# Altium project DAS_ad7606.PrjPcb
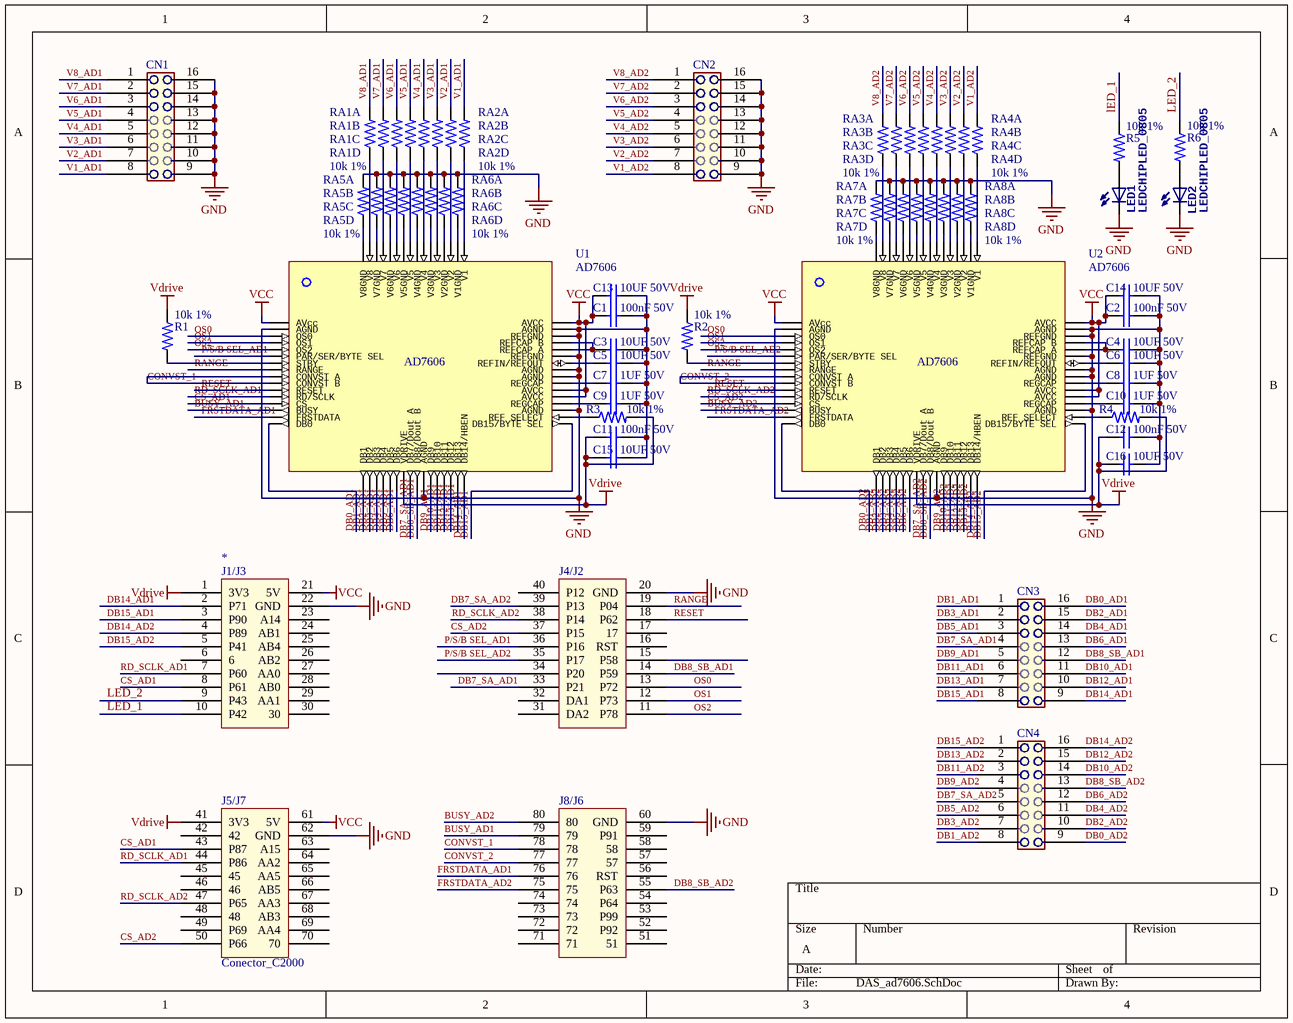
[diagram p0: DAS_ad7606.SchDoc]
1 sheet, 39 parts. Net scope: global (net labels, ports and power ports of the same name join across sheets).
Board file: DAS_ad7606.PcbDoc

## Sheet DAS_ad7606.SchDoc
size A

### Parts
*  Conector_C2000  [Conector_C2000]
C1  value 100nF 50V  [CAP0805_wave]  (hidden comment: SMD Capacitor)
C2  value 100nF 50V  [CAP0805_wave]  (hidden comment: SMD Capacitor)
C3  value 10UF 50V  [CAP0805_wave]  (hidden comment: SMD Capacitor)
C4  value 10UF 50V  [CAP0805_wave]  (hidden comment: SMD Capacitor)
C5  value 10UF 50V  [CAP0805_wave]  (hidden comment: SMD Capacitor)
C6  value 10UF 50V  [CAP0805_wave]  (hidden comment: SMD Capacitor)
C7  value 1UF 50V  [CAP0805_wave]  (hidden comment: SMD Capacitor)
C8  value 1UF 50V  [CAP0805_wave]  (hidden comment: SMD Capacitor)
C9  value 1UF 50V  [CAP0805_wave]  (hidden comment: SMD Capacitor)
C10  value 1UF 50V  [CAP0805_wave]  (hidden comment: SMD Capacitor)
C11  value 100nF 50V  [CAP0805_wave]  (hidden comment: SMD Capacitor)
C12  value 100nF 50V  [CAP0805_wave]  (hidden comment: SMD Capacitor)
C13  value 10UF 50V  [CAP0805_wave]  (hidden comment: SMD Capacitor)
C14  value 10UF 50V  [CAP0805_wave]  (hidden comment: SMD Capacitor)
C15  value 10UF 50V  [CAP0805_wave]  (hidden comment: SMD Capacitor)
C16  value 10UF 50V  [CAP0805_wave]  (hidden comment: SMD Capacitor)
CN1  Conector IDC Macho 16 Vias 90°  [HEADER 2x8 - 90g]  (value not drawn)
CN2  Conector IDC Macho 16 Vias 90°  [HEADER 2x8 - 90g]  (value not drawn)
CN3  Conector IDC Macho 16 Vias 90°  [HEADER 2x8 - 180g]  (value not drawn)
CN4  Conector IDC Macho 16 Vias 90°  [HEADER 2x8 - 180g]  (value not drawn)
LED1  LEDCHIPLED_0805  [CHIPLED_0805]
LED2  LEDCHIPLED_0805  [CHIPLED_0805]
R1  value 10k 1%  [RES0805_wave]  (hidden comment: Resistor 0805)
R2  value 10k 1%  [RES0805_wave]  (hidden comment: Resistor 0805)
R3  value 10k 1%  [RES0805_wave]  (hidden comment: Resistor 0805)
R4  value 10k 1%  [RES0805_wave]  (hidden comment: Resistor 0805)
R5  value 10k 1%  [RES0805_wave]  (hidden comment: Resistor 0805)
R6  value 10k 1%  [RES0805_wave]  (hidden comment: Resistor 0805)
RA1  Resistor Array 1206 4 vias  [RES_Array 1206 - 4 vias]  (value not drawn)  (parts A,B,C,D of 4)
RA2  Resistor Array 1206 4 vias  [RES_Array 1206 - 4 vias]  (value not drawn)  (parts A,B,C,D of 4)
RA3  Resistor Array 1206 4 vias  [RES_Array 1206 - 4 vias]  (value not drawn)  (parts A,B,C,D of 4)
RA4  Resistor Array 1206 4 vias  [RES_Array 1206 - 4 vias]  (value not drawn)  (parts A,B,C,D of 4)
RA5  Resistor Array 1206 4 vias  [RES_Array 1206 - 4 vias]  (value not drawn)  (parts A,B,C,D of 4)
RA6  Resistor Array 1206 4 vias  [RES_Array 1206 - 4 vias]  (value not drawn)  (parts A,B,C,D of 4)
RA7  Resistor Array 1206 4 vias  [RES_Array 1206 - 4 vias]  (value not drawn)  (parts A,B,C,D of 4)
RA8  Resistor Array 1206 4 vias  [RES_Array 1206 - 4 vias]  (value not drawn)  (parts A,B,C,D of 4)
U1  AD7606  [LQFP ST-64-2]
U2  AD7606  [LQFP ST-64-2]

### Nets
GND: *.20(GND) *.22(GND) *.60(GND) *.62(GND) C1.1 C2.1 C3.1 C4.1 C5.1 C6.1 C7.1 C8.1 C9.1 C10.1 C11.1 C12.1 C13.1 C14.1 C15.1 C16.1 CN1.9 CN1.10 CN1.11 CN1.12 CN1.13 CN1.14 CN1.15 CN1.16 CN2.9 CN2.10 CN2.11 CN2.12 CN2.13 CN2.14 CN2.15 CN2.16 LED1.C LED2.C RA5.R1B RA5.R2B RA5.R3B RA5.R4B RA6.R1B RA6.R2B RA6.R3B RA6.R4B RA7.R1B RA7.R2B RA7.R3B RA7.R4B RA8.R1B RA8.R2B RA8.R3B RA8.R4B U1.2(AGND) U1.26(AGND) U1.35(AGND) U1.40(AGND) U1.41(AGND) U1.43(REFGND) U1.46(REFGND) U1.47(AGND) U2.2(AGND) U2.26(AGND) U2.35(AGND) U2.40(AGND) U2.41(AGND) U2.43(REFGND) U2.46(REFGND) U2.47(AGND)
VCC: *.21(5V) *.61(5V) C1.2 C2.2 C13.2 C14.2 U1.1(AVcc) U1.37(AVCC) U1.38(AVCC) U1.48(AVCC) U2.1(AVcc) U2.37(AVCC) U2.38(AVCC) U2.48(AVCC)
Vdrive: *.1(3V3) *.41(3V3) C11.2 C12.2 C15.2 C16.2 R1.1 R2.1 R3.2 R4.2 U1.23(VDRIVE) U2.23(VDRIVE)
BUSY_AD1: *.79 U1.14(BUSY)
BUSY_AD2: *.80 U2.14(BUSY)
CONVST_1: *.78 U1.9(CONVST_A) U1.10(CONVST_B)
CONVST_2: *.77 U2.9(CONVST_A) U2.10(CONVST_B)
CS_AD1: *.8(P61) *.43(P87) U1.13(CS)
CS_AD2: *.37(P15) *.50(P66) U2.13(CS)
DB0_AD1: CN3.16 U1.16(DB0)
DB0_AD2: CN4.9 U2.16(DB0)
DB1_AD1: CN3.1 U1.17(DB1)
DB1_AD2: CN4.8 U2.17(DB1)
DB2_AD1: CN3.15 U1.18(DB2)
DB2_AD2: CN4.10 U2.18(DB2)
DB3_AD1: CN3.2 U1.19(DB3)
DB3_AD2: CN4.7 U2.19(DB3)
DB4_AD1: CN3.14 U1.20(DB4)
DB4_AD2: CN4.11 U2.20(DB4)
DB5_AD1: CN3.3 U1.21(DB5)
DB5_AD2: CN4.6 U2.21(DB5)
DB6_AD1: CN3.13 U1.22(DB6)
DB6_AD2: CN4.12 U2.22(DB6)
DB7_SA_AD1: *.33(P21) CN3.4 U1.24(DB7/Dout_A)
DB7_SA_AD2: *.39(P13) CN4.5 U2.24(DB7/Dout_A)
DB8_SB_AD1: *.14(P59) CN3.12 U1.25(DB8/Dout_B)
DB8_SB_AD2: *.55(P63) CN4.13 U2.25(DB8/Dout_B)
DB9_AD1: CN3.5 U1.27(DB9)
DB9_AD2: CN4.4 U2.27(DB9)
DB10_AD1: CN3.11 U1.28(DB10)
DB10_AD2: CN4.14 U2.28(DB10)
DB11_AD1: CN3.6 U1.29(DB11)
DB11_AD2: CN4.3 U2.29(DB11)
DB12_AD1: CN3.10 U1.30(DB12)
DB12_AD2: CN4.15 U2.30(DB12)
DB13_AD1: CN3.7 U1.31(DB13)
DB13_AD2: CN4.2 U2.31(DB13)
DB14_AD1: *.2(P71) CN3.9 U1.32(DB14/HBEN)
DB14_AD2: *.4(P89) CN4.16 U2.32(DB14/HBEN)
DB15_AD1: *.3(P90) CN3.8 U1.33(DB15/BYTE_SEL)
DB15_AD2: *.5(P41) CN4.1 U2.33(DB15/BYTE_SEL)
FRSTDATA_AD1: *.76 U1.15(FRSTDATA)
FRSTDATA_AD2: *.75 U2.15(FRSTDATA)
LED_1: *.10(P42) R5.1
LED_2: *.9(P43) R6.1
OS0: *.13(P72) U1.3(OS0) U2.3(OS0)
OS1: *.12(P73) U1.4(OS1) U2.4(OS1)
OS2: *.11(P78) U1.5(OS2) U2.5(OS2)
P/S/B SEL_AD1: *.36(P16) U1.6(PAR/SER/BYTE_SEL)
P/S/B SEL_AD2: *.35(P17) U2.6(PAR/SER/BYTE_SEL)
RANGE: *.19(P04) U1.8(RANGE) U2.8(RANGE)
RD_SCLK_AD1: *.7(P60) *.44(P86) U1.12(RD/SCLK)
RD_SCLK_AD2: *.38(P14) *.47(P65) U2.12(RD/SCLK)
RESET: *.18(P62) U1.11(RESET) U2.11(RESET)
V1_AD1: CN1.8 RA2.R4B
V1_AD2: CN2.8 RA4.R4B
V2_AD1: CN1.7 RA2.R3B
V2_AD2: CN2.7 RA4.R3B
V3_AD1: CN1.6 RA2.R2B
V3_AD2: CN2.6 RA4.R2B
V4_AD1: CN1.5 RA2.R1B
V4_AD2: CN2.5 RA4.R1B
V5_AD1: CN1.4 RA1.R4B
V5_AD2: CN2.4 RA3.R4B
V6_AD1: CN1.3 RA1.R3B
V6_AD2: CN2.3 RA3.R3B
V7_AD1: CN1.2 RA1.R2B
V7_AD2: CN2.2 RA3.R2B
V8_AD1: CN1.1 RA1.R1B
V8_AD2: CN2.1 RA3.R1B
NetC3_2: C3.2 U1.44(REFCAP_A) U1.45(REFCAP_B)
NetC4_2: C4.2 U2.44(REFCAP_A) U2.45(REFCAP_B)
NetC5_2: C5.2 U1.42(REFIN/REFOUT)
NetC6_2: C6.2 U2.42(REFIN/REFOUT)
NetC7_2: C7.2 U1.39(REGCAP)
NetC8_2: C8.2 U2.39(REGCAP)
NetC9_2: C9.2 U1.36(REGCAP)
NetC10_2: C10.2 U2.36(REGCAP)
NetLED1_A: LED1.A R5.2
NetLED2_A: LED2.A R6.2
NetR1_2: R1.2 U1.7(STBY)
NetR2_2: R2.2 U2.7(STBY)
NetR3_1: R3.1 U1.34(REF_SELECT)
NetR4_1: R4.1 U2.34(REF_SELECT)
NetRA1_R1A: RA1.R1A U1.63(V8)
NetRA1_R2A: RA1.R2A U1.61(V7)
NetRA1_R3A: RA1.R3A U1.59(V6)
NetRA1_R4A: RA1.R4A U1.57(V5)
NetRA2_R1A: RA2.R1A U1.55(V4)
NetRA2_R2A: RA2.R2A U1.53(V3)
NetRA2_R3A: RA2.R3A U1.51(V2)
NetRA2_R4A: RA2.R4A U1.49(V1)
NetRA3_R1A: RA3.R1A U2.63(V8)
NetRA3_R2A: RA3.R2A U2.61(V7)
NetRA3_R3A: RA3.R3A U2.59(V6)
NetRA3_R4A: RA3.R4A U2.57(V5)
NetRA4_R1A: RA4.R1A U2.55(V4)
NetRA4_R2A: RA4.R2A U2.53(V3)
NetRA4_R3A: RA4.R3A U2.51(V2)
NetRA4_R4A: RA4.R4A U2.49(V1)
NetRA5_R1A: RA5.R1A U1.64(V8GND)
NetRA5_R2A: RA5.R2A U1.62(V7GND)
NetRA5_R3A: RA5.R3A U1.60(V6GND)
NetRA5_R4A: RA5.R4A U1.58(V5GND)
NetRA6_R1A: RA6.R1A U1.56(V4GND)
NetRA6_R2A: RA6.R2A U1.54(V3GND)
NetRA6_R3A: RA6.R3A U1.52(V2GND)
NetRA6_R4A: RA6.R4A U1.50(V1GND)
NetRA7_R1A: RA7.R1A U2.64(V8GND)
NetRA7_R2A: RA7.R2A U2.62(V7GND)
NetRA7_R3A: RA7.R3A U2.60(V6GND)
NetRA7_R4A: RA7.R4A U2.58(V5GND)
NetRA8_R1A: RA8.R1A U2.56(V4GND)
NetRA8_R2A: RA8.R2A U2.54(V3GND)
NetRA8_R3A: RA8.R3A U2.52(V2GND)
NetRA8_R4A: RA8.R4A U2.50(V1GND)

Not connected (* = marked no-connect by the designer): * 6 15(P58) 16(RST) 17 23(A14) 24(AB1) 25(AB4) 26(AB2) 27(AA0) 28(AB0) 29(AA1) 30 31(DA2) 32(DA1) 34(P20) 40(P12) 42 45 46 48 49(P69) 51 52(P92) 53(P99) 54(P64) 56(RST) 57 58 59(P91) 63(A15) 64(AA2) 65(AA5) 66(AB5) 67(AA3) 68(AB3) 69(AA4) 70 71 72 73 74

### Notes on the sheet
- (in symbol Conector_C2000) J1/J3; J4/J2; J5/J7; J8/J6

### Library data of the parts
C1-C6 C11-C16 = Capacitor 0805: CAP CER 100nF 50V 10%  0805; Manufacturer: ANY; Temperature Coefficient: X7R; RoHS: RoHS Compliant; Tolerance: ±10%; Voltage - Rated: 50V; Mounting Type: Surface Mount, MLCC; Operating Temperature: -55°C ~ 125°C; Package / Case: 0805 (2012 Metric); Size / Dimension: 0.079" L x 0.049" W (2.00mm x 1.25mm); Height - Seated (Max): -; Thickness (Max): 0.035" (0.88mm); Lead Spacing: -; Features: -; Lead Style: -; ComponentLink1URL: http://www.kemet.com/docfinder?Partnumber=C0805C102K5RACTU; ComponentLink1Description: http://www.kemet.com/docfinder?Partnumber=C0805C102K5RACTU
C7-C10 = Capacitor 0805: CAP CER 1UF 50V 10%  0805; Manufacturer: ANY; Temperature Coefficient: X7R; RoHS: RoHS Compliant; Tolerance: ±10%; Voltage - Rated: 50V; Mounting Type: Surface Mount, MLCC; Operating Temperature: -55°C ~ 125°C; Package / Case: 0805 (2012 Metric); Size / Dimension: 0.079" L x 0.049" W (2.00mm x 1.25mm); Height - Seated (Max): -; Thickness (Max): 0.035" (0.88mm); Lead Spacing: -; Features: -; Lead Style: -; ComponentLink1URL: http://www.kemet.com/docfinder?Partnumber=C0805C102K5RACTU; ComponentLink1Description: http://www.kemet.com/docfinder?Partnumber=C0805C102K5RACTU
CN1-CN4 = Conector IDC Macho 16 Vias 90°: Value: 16vias
LED1 LED2 = LEDCHIPLED_0805: <b>LED</b><p> / <u>OSRAM</u>:<br> / - <u>CHIPLED</u><br> / LG R971, LG N971, LY N971, LG Q971, LY Q971, LO R971, LY R971 / LH N974, LH R974<br> / LS Q976, LO Q976, LY Q976<br> / LO Q996<br> / - <u>Hyper CHIPLED</u><br> / LW Q18S<br> / LB Q993, LB Q99A, LB R99A<br> / - <u>SideLED</u><br> / LS A670, LO A670, LY A670, LG A670, LP A670<br> / LB A673, LV A673, LT A673, LW A673<br> / LH A674<br> / LY A675<br> / LS A676, LA A676, LO A676, LY A676, LW A676<br> / LS A679, LY A679, LG A679<br> / -  <u>Hyper Micro SIDELED®</u><br> / LS Y876, LA Y876, LO Y876, LY Y876<br> / LT Y87S<br> / - <u>SmartLED</u><br> / LW L88C, LW L88S<br> / LB L89C, LB L89S, LG L890<br> / LS L89K, LO L89K, LY L89K<br> / LS L896, LA L896, LO L896, LY L896<br> / - <u>TOPLED</u><br> / LS T670, LO T670, LY T670, LG T670, LP T670<br> / LSG T670, LSP T670, LSY T670, LOP T670, LYG T670<br> / LG T671, LOG T671, LSG T671<br> / LB T673, LV T673, LT T673, LW T673<br> / LH T674<br> / LS T676, LA T676, LO T676, LY T676, LB T676, LH T676, LSB T676, LW T676<br> / LB T67C, LV T67C, LT T67C, LS T67K, LO T67K, LY T67K, LW E67C<br> / LS E67B, LA E67B, LO E67B, LY E67B, LB E67C, LV E67C, LT E67C<br> / LW T67C<br> / LS T679, LY T679, LG T679<br> / LS T770, LO T770, LY T770, LG T770, LP T770<br> / LB T773, LV T773, LT T773, LW T773<br> / LH T774<br> / LS E675, LA E675, LY E675, LS T675<br> / LS T776, LA T776, LO T776, LY T776, LB T776<br> / LHGB T686<br> / LT T68C, LB T68C<br> / - <u>Hyper Mini TOPLED®</u><br> / LB M676<br> / - <u>Mini TOPLED Santana®</u><br> / LG M470<br> / LS M47K, LO M47K, LY M47K / <p> / Source: http://www.osram.convergy.de<p> / <u>LUXEON:</u><br> / - <u>LUMILED®</u><br> / LXK2-PW12-R00, LXK2-PW12-S00, LXK2-PW14-U00, LXK2-PW14-V00<br> / LXK2-PM12-R00, LXK2-PM12-S00, LXK2-PM14-U00<br> / LXK2-PE12-Q00, LXK2-PE12-R00, LXK2-PE12-S00, LXK2-PE14-T00, LXK2-PE14-U00<br> / LXK2-PB12-K00, LXK2-PB12-L00, LXK2-PB12-M00, LXK2-PB14-N00, LXK2-PB14-P00, LXK2-PB14-Q00<br> / LXK2-PR12-L00, LXK2-PR12-M00, LXK2-PR14-Q00, LXK2-PR14-R00<br> / LXK2-PD12-Q00, LXK2-PD12-R00, LXK2-PD12-S00<br> / LXK2-PH12-R00, LXK2-PH12-S00<br> / LXK2-PL12-P00, LXK2-PL12-Q00, LXK2-PL12-R00 / <p> / Source: www.luxeon.com<p> / <u>KINGBRIGHT:</U><p> / KA-3528ASYC<br> / Source: www.kingbright.com
R1-R6 = Resistor 0805: RES SMD 10K OHM 1% 1/8W 0805; Manufacturer: ANY; Power (Watts): 0.125W, 1/8W; Temperature Coefficient: ±100ppm/°C; RoHS: RoHS Compliant; Category: Resistors; Composition: Thick Film; Features: Moisture Resistant; Operating Temperature: -55°C ~ 155°C; Package / Case: 0805 (2012 Metric); Size / Dimension: 0.079" L x 0.049" W (2.00mm x 1.25mm); Height: 0.024" (0.60mm); ComponentLink1URL: http://www.yageo.com/documents/recent/PYu-RC_Group_51_RoHS_L_2.pdf; ComponentLink1Description: http://www.yageo.com/documents/recent/PYu-RC_Group_51_RoHS_L_2.pdf
RA1-RA8 = Resistor Array 1206 4 vias: RES ARRAY 4 RES 10K OHM 1206; pin to pad: R1A>1 R1B>8 R2A>2 R2B>7 R3A>3 R3B>6 R4A>4 R4B>5; Manufacturer: Yageo; Manufacturer Part Number: YC164-JR-0710KL; Circuit Type: Isolated; Tolerance: ±5%; Number of Resistors: 4; Power Per Element: 62.5mW; Temperature Coefficient: ±200ppm/°C; Value: 10k 1%; RoHS: RoHS Compliant; Category: Resistors; Packaging: Tape & Reel (TR); Resistance (Ohms): 10k; Number of Pins: 8; Operating Temperature: -55°C ~ 155°C; Applications: DDRAM, SDRAM; Mounting Type: Surface Mount; Package / Case: 1206 (3216 Metric), Convex, Long Side Terminals; Size / Dimension: 0.126" L x 0.063" W (3.20mm x 1.60mm); Height: 0.028" (0.70mm); ComponentLink1URL: http://www.yageo.com/NewPortal/yageodocoutput?fileName=/pdf/R-Chip/PYu-YC_TC_group_51_RoHS_L_2.pdf; ComponentLink1Description: http://www.yageo.com/NewPortal/yageodocoutput?fileName=/pdf/R-Chip/PYu-YC_TC_group_51_RoHS_L_2.pdf
U1 U2 = AD7606: DAS ADC